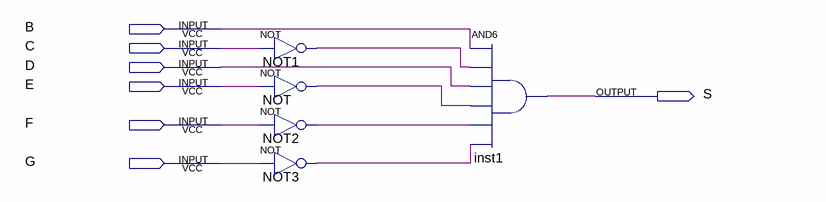
[diagram p0: schematic sheet]
// Quartus schematic Block3.bdf as structural Verilog: 5 symbols, 7 pins
module Block3 (
  input  B,
  input  C,
  input  D,
  input  E,
  input  F,
  input  G,
  output S
);

  wire NOT1_out, NOT2_out, NOT3_out, NOT_out;

  not NOT1 (NOT1_out, C);
  not NOT (NOT_out, E);
  not NOT2 (NOT2_out, F);
  not NOT3 (NOT3_out, G);
  and inst1 (S, B, NOT1_out, D, NOT_out, NOT2_out, NOT3_out);
endmodule
